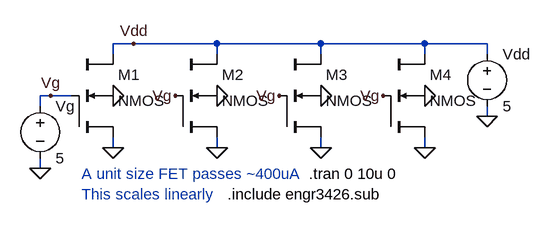
[diagram p0: schematic isat-test.asc]
isat-test.asc, the LTspice schematic file:
Version 4
SHEET 1 904 680
WIRE 240 96 208 96
WIRE 368 96 240 96
WIRE 528 96 368 96
WIRE 688 96 528 96
WIRE 784 96 688 96
WIRE 208 112 208 96
WIRE 368 112 368 96
WIRE 528 112 528 96
WIRE 688 112 688 96
WIRE 784 112 784 96
WIRE 112 176 96 176
WIRE 144 176 112 176
WIRE 96 192 96 176
WIRE 784 208 784 192
WIRE 208 256 208 240
WIRE 368 256 368 240
WIRE 528 256 528 240
WIRE 688 256 688 240
WIRE 96 288 96 272
FLAG 208 256 0
FLAG 784 208 0
FLAG 208 176 0
FLAG 96 288 0
FLAG 240 96 Vdd
FLAG 112 176 Vg
FLAG 368 256 0
FLAG 368 176 0
FLAG 304 176 Vg
FLAG 528 256 0
FLAG 528 176 0
FLAG 464 176 Vg
FLAG 688 256 0
FLAG 688 176 0
FLAG 624 176 Vg
SYMBOL cktsym\\nmos4 208 176 R0
SYMATTR InstName M1
SYMATTR Value2 l=1u w=1u
SYMBOL voltage 784 96 R0
WINDOW 123 0 0 Left 2
WINDOW 39 0 0 Left 2
SYMATTR InstName Vdd
SYMATTR Value 5
SYMBOL voltage 96 176 R0
SYMATTR InstName Vg
SYMATTR Value 5
SYMBOL cktsym\\nmos4 368 176 R0
SYMATTR InstName M2
SYMATTR Value2 l=1u w=2u
SYMBOL cktsym\\nmos4 528 176 R0
SYMATTR InstName M3
SYMATTR Value2 l=1u w=3u
SYMBOL cktsym\\nmos4 688 176 R0
SYMATTR InstName M4
SYMATTR Value2 l=1u w=4u
TEXT 510 296 Left 2 !.tran 0 10u 0
TEXT 384 328 Left 2 !.include engr3426.sub
TEXT 160 296 Left 2 ;A unit size FET passes ~400uA
TEXT 160 328 Left 2 ;This scales linearly

The netlist it stands for:
* isat-test.asc
M1 Vdd Vg 0 0 NMOS l=1u w=1u
Vdd Vdd 0 5
Vg Vg 0 5
M2 Vdd Vg 0 0 NMOS l=1u w=2u
M3 Vdd Vg 0 0 NMOS l=1u w=3u
M4 Vdd Vg 0 0 NMOS l=1u w=4u
.model NMOS NMOS
.model PMOS PMOS
.lib standard.mos
.tran 0 10u 0
.include engr3426.sub
* A unit size FET passes ~400uA
* This scales linearly
.backanno
.end